# EAGLE schematic EXT_EXPANDER (EAGLE 6.5.0)
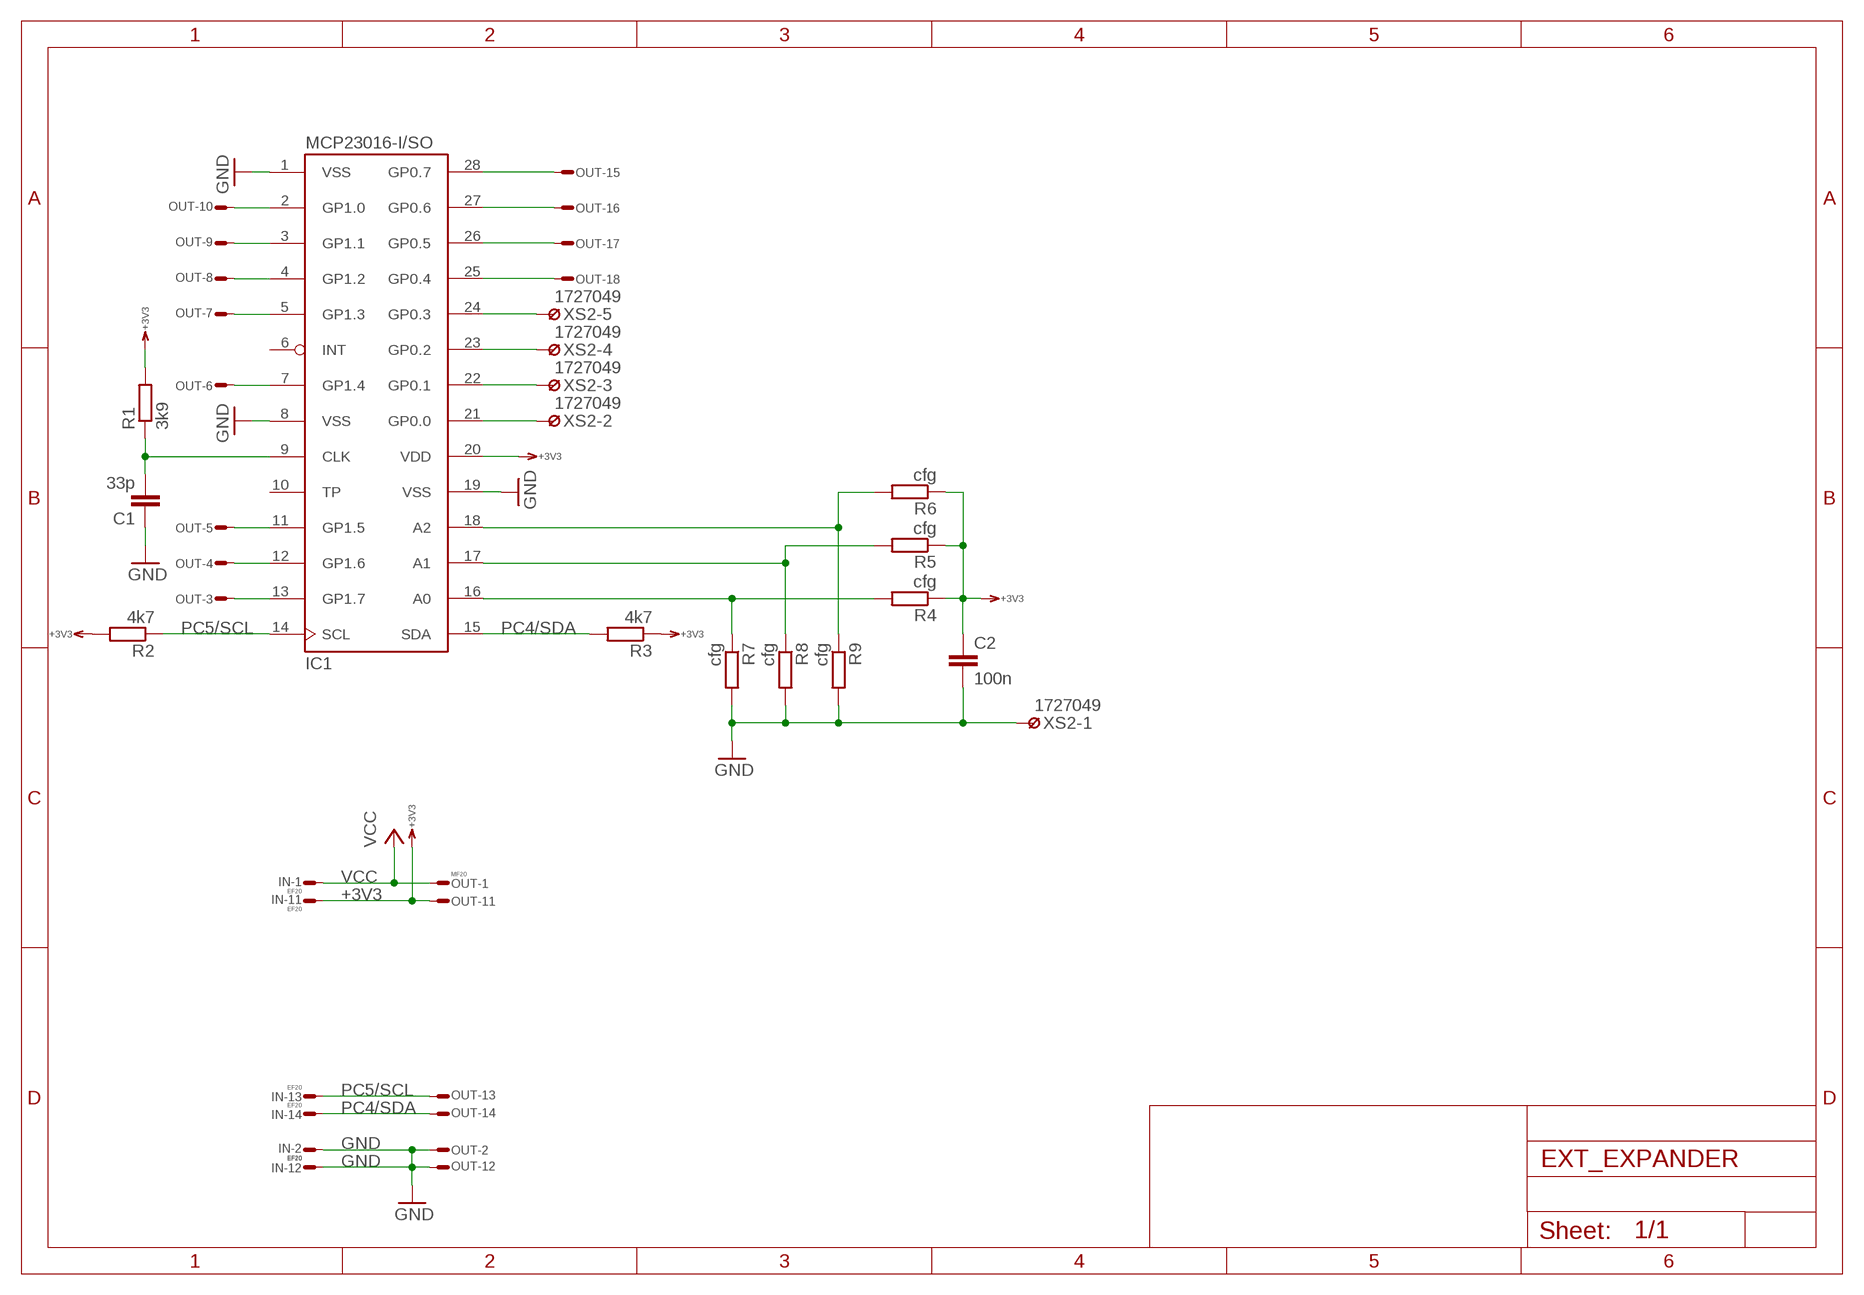
[diagram p0: schematic, sheet 1]

## Parts
C1  33p  C0603  [0603]
C2  100n  C0603  [0603]
IC1  MCP23016-I/SO  [SOIC28]
IN  EF20  FE20ELS  [FE10-2WS]
OUT  MF20  ML20LSE  [ML20LS]
R1  3k9  R0603  [0603]
R2  4k7  R0603  [0603]
R3  4k7  R0603  [0603]
R4  cfg  R0603  [0603]
R5  cfg  R0603  [0603]
R6  cfg  R0603  [0603]
R7  cfg  R0603  [0603]
R8  cfg  R0603  [0603]
R9  cfg  R0603  [0603]
XS2  1727049  [1727049]

## Nets
+3V3: C2.1 IC1.20(VDD) IN.P$11 OUT.P$11 R1.2 R2.2 R3.1 R4.1 R5.1 R6.1
GND: C1.1 C2.2 IC1.1(VSS) IC1.8(VSS) IC1.19(VSS) IN.P$2 IN.P$12 OUT.P$2 OUT.P$12 R7.2 R8.2 R9.2 XS2.1
N$1: C1.2 IC1.9(CLK) R1.1
N$2: IC1.7(GP1.4) OUT.P$6
N$3: IC1.5(GP1.3) OUT.P$7
N$4: IC1.4(GP1.2) OUT.P$8
N$5: IC1.3(GP1.1) OUT.P$9
N$6: IC1.2(GP1.0) OUT.P$10
N$7: IC1.11(GP1.5) OUT.P$5
N$8: IC1.12(GP1.6) OUT.P$4
N$9: IC1.13(GP1.7) OUT.P$3
N$10: IC1.16(A0) R4.2 R7.1
N$11: IC1.17(A1) R5.2 R8.1
N$12: IC1.18(A2) R6.2 R9.1
N$13: IC1.21(GP0.0) XS2.2
N$14: IC1.22(GP0.1) XS2.3
N$15: IC1.23(GP0.2) XS2.4
N$16: IC1.24(GP0.3) XS2.5
N$17: IC1.25(GP0.4) OUT.P$18
N$18: IC1.26(GP0.5) OUT.P$17
N$19: IC1.27(GP0.6) OUT.P$16
N$20: IC1.28(GP0.7) OUT.P$15
PC4/SDA: IC1.15(SDA) IN.P$14 OUT.P$14 R3.2
PC5/SCL: IC1.14(SCL) IN.P$13 OUT.P$13 R2.1
VCC: IN.P$1 OUT.P$1
Unconnected: IC1.6(INT) IC1.10(TP) IN.P$3 IN.P$4 IN.P$5 IN.P$6 IN.P$7 IN.P$8 IN.P$9 IN.P$10 IN.P$15 IN.P$16 IN.P$17 IN.P$18 IN.P$19 IN.P$20 OUT.P$19 OUT.P$20

## Library data of the parts
C1 C2 = RCL:C: Capacitor SMD
IC1 = ICs:MCP23016
IN = Conn:FE20E
OUT = Conn:ML20?E: HARTING
R1-R9 = RCL:R: Resistor SMD
XS2 = Conn:1727049